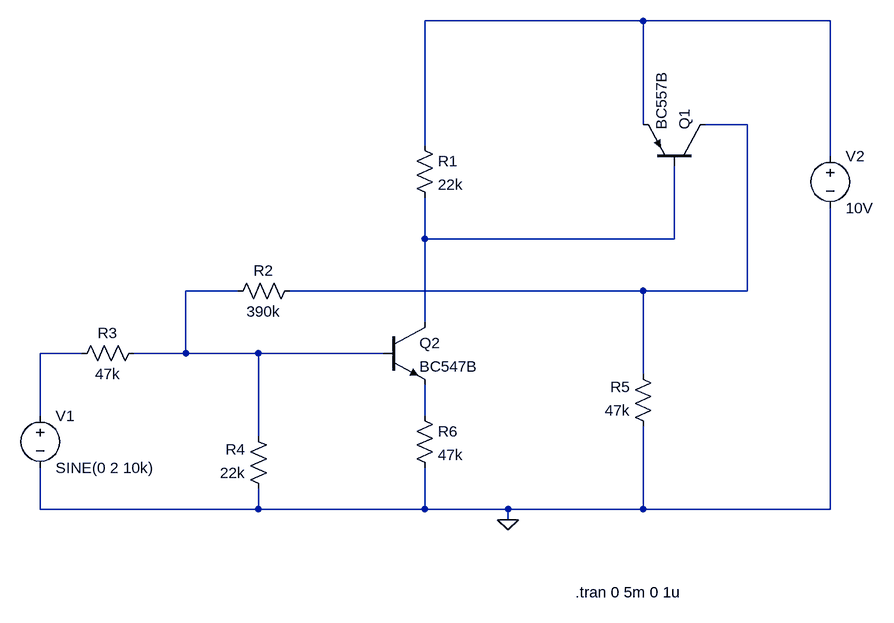
[diagram p0: schematic schmitt trigger.asc]
schmitt trigger.asc, the LTspice schematic file:
Version 4.1
SHEET 1 936 800
WIRE 576 -96 240 -96
WIRE 864 -96 576 -96
WIRE 576 64 576 -96
WIRE 736 64 672 64
WIRE 240 96 240 -96
WIRE 864 112 864 -96
WIRE 240 240 240 176
WIRE 624 240 624 128
WIRE 624 240 240 240
WIRE -48 320 -128 320
WIRE 576 320 32 320
WIRE 736 320 736 64
WIRE 736 320 576 320
WIRE 240 368 240 240
WIRE -288 416 -352 416
WIRE -128 416 -128 320
WIRE -128 416 -208 416
WIRE -16 416 -128 416
WIRE 176 416 -16 416
WIRE 576 448 576 320
WIRE -352 512 -352 416
WIRE 240 512 240 464
WIRE -16 544 -16 416
WIRE -352 656 -352 592
WIRE -16 656 -16 624
WIRE -16 656 -352 656
WIRE 240 656 240 592
WIRE 240 656 -16 656
WIRE 368 656 240 656
WIRE 576 656 576 528
WIRE 576 656 368 656
WIRE 864 656 864 192
WIRE 864 656 576 656
WIRE 368 672 368 656
FLAG 368 672 0
SYMBOL res 224 80 R0
SYMATTR InstName R1
SYMATTR Value 22k
SYMBOL res 48 304 R90
WINDOW 0 0 56 VBottom 2
WINDOW 3 32 56 VTop 2
SYMATTR InstName R2
SYMATTR Value 390k
SYMBOL res -192 400 R90
WINDOW 0 0 56 VBottom 2
WINDOW 3 32 56 VTop 2
SYMATTR InstName R3
SYMATTR Value 47k
SYMBOL res 0 640 R180
WINDOW 0 36 76 Left 2
WINDOW 3 36 40 Left 2
SYMATTR InstName R4
SYMATTR Value 22k
SYMBOL res 592 544 R180
WINDOW 0 36 76 Left 2
WINDOW 3 36 40 Left 2
SYMATTR InstName R5
SYMATTR Value 47k
SYMBOL pnp 672 128 M270
SYMATTR InstName Q1
SYMATTR Value BC557B
SYMBOL npn 176 368 R0
SYMATTR InstName Q2
SYMATTR Value BC547B
SYMBOL voltage -352 496 R0
WINDOW 123 0 0 Left 0
WINDOW 39 0 0 Left 0
SYMATTR InstName V1
SYMATTR Value SINE(0 2 10k)
SYMBOL res 224 496 R0
SYMATTR InstName R6
SYMATTR Value 47k
SYMBOL voltage 864 96 R0
WINDOW 123 0 0 Left 0
WINDOW 39 0 0 Left 0
SYMATTR InstName V2
SYMATTR Value 10V
TEXT 472 784 Left 2 !.tran 0 5m 0 1u

The netlist it stands for:
* schmitt trigger.asc
R1 N001 N003 22k
R2 N002 N004 390k
R3 N004 N005 47k
R4 0 N004 22k
R5 0 N002 47k
Q1 N002 N003 N001 0 BC557B
Q2 N003 N004 N006 0 BC547B
V1 N005 0 SINE(0 2 10k)
R6 N006 0 47k
V2 N001 0 10V
.model NPN NPN
.model PNP PNP
.lib standard.bjt
.tran 0 5m 0 1u
.backanno
.end